# Altium schematic sheet Indikator.SchDoc
size A
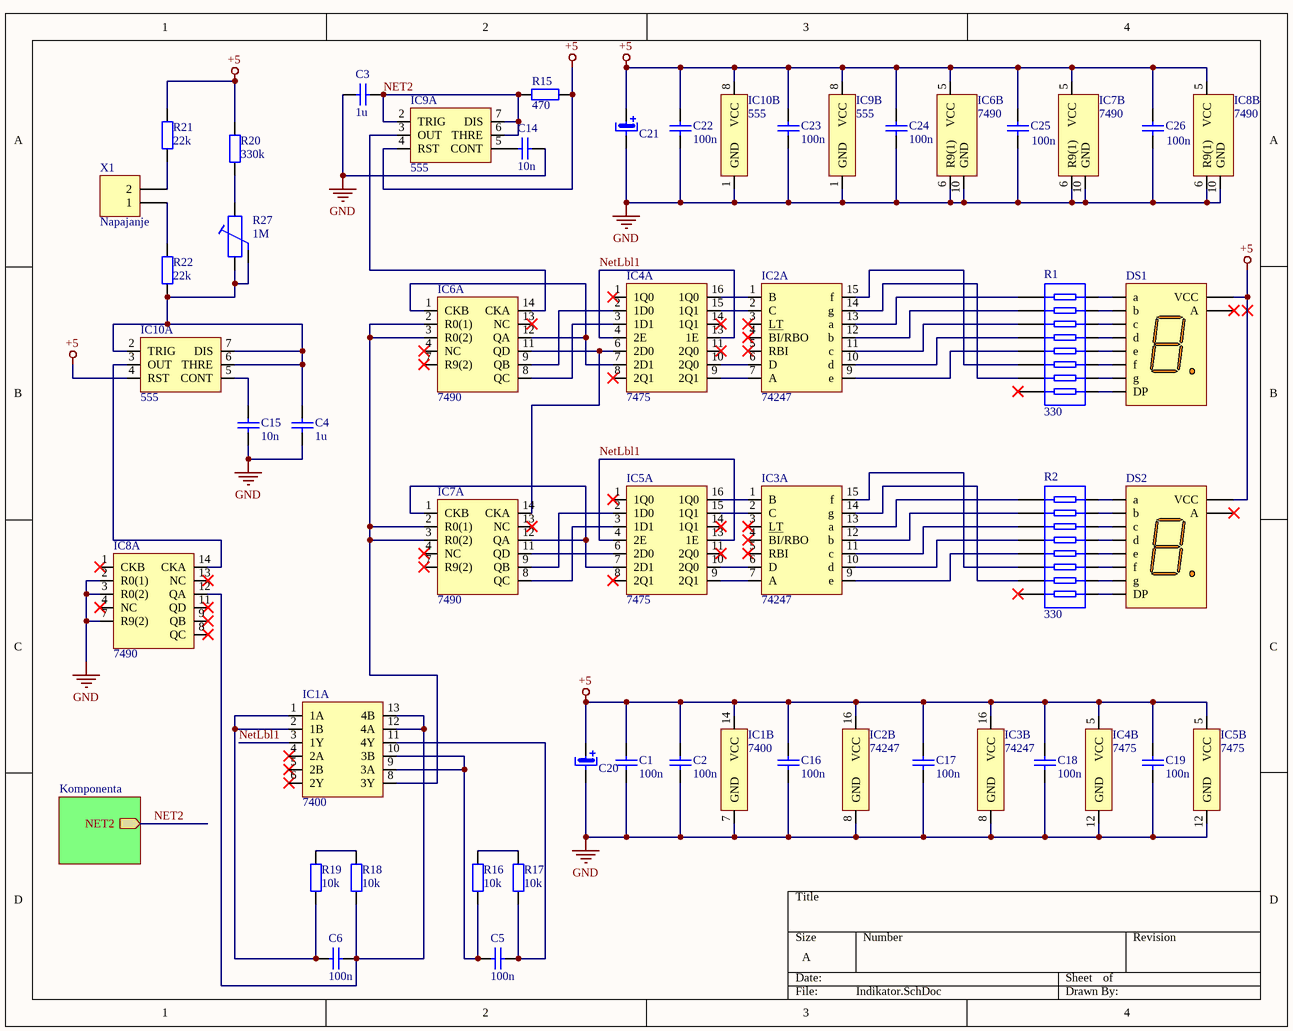
[diagram p0: Indikator.SchDoc]

## Parts
C1  100n  [RAD-0.3]
C2  100n  [RAD-0.3]
C3  1u  [RAD-0.3]
C4  1u  [RAD-0.3]
C5  100n  [RAD-0.3]
C6  100n  [RAD-0.3]
C14  10n  [RAD-0.3]
C15  10n  [RAD-0.3]
C16  100n  [RAD-0.3]
C17  100n  [RAD-0.3]
C18  100n  [RAD-0.3]
C19  100n  [RAD-0.3]
C20  Elko  [RB7.6-15]  (value not drawn)
C21  Elko  [RB7.6-15]  (value not drawn)
C22  100n  [RAD-0.3]
C23  100n  [RAD-0.3]
C24  100n  [RAD-0.3]
C25  100n  [RAD-0.3]
C26  100n  [RAD-0.3]
DS1  Dpy Amber-CA  [A]  (value not drawn)
DS2  Dpy Amber-CA  [A]  (value not drawn)
IC1  7400  [DIP-14]  (parts A,B of 2)
IC2  74247  [DIP-16]  (parts A,B of 2)
IC3  74247  [DIP-16]  (parts A,B of 2)
IC4  7475  [DIP-16]  (parts A,B of 2)
IC5  7475  [DIP-16]  (parts A,B of 2)
IC6  7490  [DIP-14]  (parts A,B of 2)
IC7  7490  [DIP-14]  (parts A,B of 2)
IC8  7490  [DIP-14]  (parts A,B of 2)
IC9  555  [DIP-8]  (parts A,B of 2)
IC10  555  [DIP-8]  (parts A,B of 2)
R1  330  [SSOP16_N]
R2  330  [SSOP16_N]
R15  470  [AXIAL-0.4]
R16  10k  [AXIAL-0.4]
R17  10k  [AXIAL-0.4]
R18  10k  [AXIAL-0.4]
R19  10k  [AXIAL-0.4]
R20  330k  [AXIAL-0.4]
R21  22k  [AXIAL-0.4]
R22  22k  [AXIAL-0.4]
R27  1M  [14-1210]
X1  Napajanje  [HDR1X2]

## Sub-sheets
Komponenta = Komponenta: NET2 (out)

## Nets
+5: C1.2 C2.2 C16.2 C17.2 C18.2 C19.2 C20.1 C21.1 C22.2 C23.2 C24.2 C25.2 C26.2 DS1.1(VCC) DS2.1(VCC) IC1.14(VCC) IC2.16(VCC) IC3.16(VCC) IC4.5(VCC) IC5.5(VCC) IC6.5(VCC) IC7.5(VCC) IC8.5(VCC) IC9.4(RST) IC9.8(VCC) IC10.4(RST) IC10.8(VCC) R15.2 R20.2 R21.2
GND: C1.1 C2.1 C3.1 C4.2 C14.2 C15.1 C16.1 C17.1 C18.1 C19.1 C20.2 C21.2 C22.1 C23.1 C24.1 C25.1 C26.1 IC1.7(GND) IC2.8(GND) IC3.8(GND) IC4.12(GND) IC5.12(GND) IC6.6(R9(1)) IC6.10(GND) IC7.6(R9(1)) IC7.10(GND) IC8.2(R0(1)) IC8.3(R0(2)) IC8.6(R9(1)) IC8.7(R9(2)) IC8.10(GND) IC9.1(GND) IC10.1(GND)
NET2: C3.2 IC9.2(TRIG) IC9.6(THRE) IC9.7(DIS) R15.1 ; sheet Komponenta/NET2
NetLbl1: IC1.3(1Y) IC4.4(2E) IC4.13(1E) IC5.4(2E) IC5.13(1E)
NetC4_1: C4.1 IC10.2(TRIG) IC10.6(THRE) IC10.7(DIS) R22.2 R27.1 R27.2
NetC5_1: C5.1 IC1.11(4Y) R17.1
NetC5_2: C5.2 IC1.9(3A) IC1.10(3B) R16.1
NetC6_1: C6.1 IC1.12(4A) IC1.13(4B) IC8.12(QA) R18.1
NetC6_2: C6.2 IC1.1(1A) IC1.2(1B) R19.1
NetC14_1: C14.1 IC9.5(CONT)
NetC15_2: C15.2 IC10.5(CONT)
NetDS1_2: DS1.2(f) R1.11
NetDS1_3: DS1.3(g) R1.10
NetDS1_4: DS1.4(e) R1.12
NetDS1_5: DS1.5(d) R1.13
NetDS1_7: DS1.7(DP) R1.9
NetDS1_8: DS1.8(c) R1.14
NetDS1_9: DS1.9(b) R1.15
NetDS1_10: DS1.10(a) R1.16
NetDS2_2: DS2.2(f) R2.11
NetDS2_3: DS2.3(g) R2.10
NetDS2_4: DS2.4(e) R2.12
NetDS2_5: DS2.5(d) R2.13
NetDS2_7: DS2.7(DP) R2.9
NetDS2_8: DS2.8(c) R2.14
NetDS2_9: DS2.9(b) R2.15
NetDS2_10: DS2.10(a) R2.16
NetIC1_8: IC1.8(3Y) IC6.2(R0(1)) IC6.3(R0(2)) IC7.2(R0(1)) IC7.3(R0(2))
NetIC2_1: IC2.1(B) IC4.16(1Q0)
NetIC2_2: IC2.2(C) IC4.15(1Q1)
NetIC2_6: IC2.6(D) IC4.10(2Q0)
NetIC2_7: IC2.7(A) IC4.9(2Q1)
NetIC2_9: IC2.9(e) R1.5
NetIC2_10: IC2.10(d) R1.4
NetIC2_11: IC2.11(c) R1.3
NetIC2_12: IC2.12(b) R1.2
NetIC2_13: IC2.13(a) R1.1
NetIC2_14: IC2.14(g) R1.7
NetIC2_15: IC2.15(f) R1.6
NetIC3_1: IC3.1(B) IC5.16(1Q0)
NetIC3_2: IC3.2(C) IC5.15(1Q1)
NetIC3_6: IC3.6(D) IC5.10(2Q0)
NetIC3_7: IC3.7(A) IC5.9(2Q1)
NetIC3_9: IC3.9(e) R2.5
NetIC3_10: IC3.10(d) R2.4
NetIC3_11: IC3.11(c) R2.3
NetIC3_12: IC3.12(b) R2.2
NetIC3_13: IC3.13(a) R2.1
NetIC3_14: IC3.14(g) R2.7
NetIC3_15: IC3.15(f) R2.6
NetIC4_2: IC4.2(1D0) IC6.9(QB)
NetIC4_3: IC4.3(1D1) IC6.8(QC)
NetIC4_6: IC4.6(2D0) IC6.11(QD) IC7.14(CKA)
NetIC4_7: IC4.7(2D1) IC6.1(CKB) IC6.12(QA)
NetIC5_2: IC5.2(1D0) IC7.9(QB)
NetIC5_3: IC5.3(1D1) IC7.8(QC)
NetIC5_6: IC5.6(2D0) IC7.11(QD)
NetIC5_7: IC5.7(2D1) IC7.1(CKB) IC7.12(QA)
NetIC6_14: IC6.14(CKA) IC9.3(OUT)
NetIC8_14: IC8.14(CKA) IC10.3(OUT)
NetR16_2: R16.2 R17.2
NetR18_2: R18.2 R19.2
NetR20_1: R20.1 R27.0
NetR21_1: R21.1 X1.2
NetR22_1: R22.1 X1.1

Not connected (* = marked no-connect by the designer): DS1 6(A)*; DS2 6(A)*; IC1 4(2A)* 5(2B)* 6(2Y)*; IC2 3(LT)* 4(BI/RBO)* 5(RBI)*; IC3 3(LT)* 4(BI/RBO)* 5(RBI)*; IC4 1(1Q0)* 8(2Q1)* 11(2Q0)* 14(1Q1)*; IC5 1(1Q0)* 8(2Q1)* 11(2Q0)* 14(1Q1)*; IC6 4(NC)* 7(R9(2))* 13(NC)*; IC7 4(NC)* 7(R9(2))* 13(NC)*; IC8 1(CKB)* 4(NC)* 8(QC)* 9(QB)* 11(QD)* 13(NC)*; R1 8*; R2 8*

## Library data of the parts
C1-C6 C15-C19 C22-C26 = Cap: Capacitor; Published: 8-Jun-2000; LatestRevisionDate: 17-Jul-2002; LatestRevisionNote: Re-released for DXP Platform.; PackageReference: RAD-0.3; Publisher: Altium Limited; PackageDescription: Radial Cap, Thru-Hole; 2 Leads; 0.3 in Pin Spacing
C14 = Cap: Capacitor; Value: 100pF; Published: 8-Jun-2000; LatestRevisionDate: 17-Jul-2002; LatestRevisionNote: Re-released for DXP Platform.; PackageReference: RAD-0.3; Publisher: Altium Limited; PackageDescription: Radial Cap, Thru-Hole; 2 Leads; 0.3 in Pin Spacing
C20 C21 = Elko: Dobavljač: Farnell; Kat. broj: 1236670
DS1 DS2 = Dpy Amber-CA: 7.62 mm Black Surface Orange 7-Segment Display: CA, RH DP; MinimumIntensity: 354 ucd; Note: IF = 5 mA; Note: Pins 1 and 6 are redundant Anodes.; Published: 8-Jun-2000; LatestRevisionDate: 17-Dec-2003; LatestRevisionNote: Schematic revised, PCB Footprint replaced.; DatasheetVersion: 19-Feb-2002; PackageVersion: 11-Feb-2002; PackageReference: A; Publisher: Altium Limited; PackageDescription: LED, 7-Segment Display, 7.62 mm, RHD; 10 Leads; Row Space 5.08 mm; Pitch 2.54 mm; Colour: Orange; ComponentLink1Description: Manufacturer Link; ComponentLink1URL: http://www.agilent.com/
IC1 = 7400: Cijena: 0.441; Dobavljač: Farnell; Kat. broj: 3120183; Tip: 7400
IC2 IC3 = 74247: Cijena: 1.41; Dobavljač: Farnell; Kat. broj: 3119930; Tip: 74247
IC4 = 7475: Dobavljač: Farnell; Kat. broj: 3120693
IC5 = 7475: Cijena: 0.691; Dobavljač: Farnell; Kat. broj: 3120693; Tip: 7475
IC6 = 7490: Dobavljač: Farnell; Kat. broj: 1470790
IC7 IC8 = 7490: Cijena: 1.33; Dobavljač: Farnell; Kat. broj: 1470790; Tip: 7490
IC9 IC10 = 555: Cijena: 0.232; Dobavljač: Farnell; Kat. broj: 3121192RL; Tip: 555
R1 R2 = Res Pack4: Isolated Resistor Network; Published: 24-Mar-1999; LatestRevisionDate: 29-May-2009; LatestRevisionNote: IPC-7351 Footprint Added.; PackageVersion: Oct-2003; PackageReference: SSOP16; Publisher: Altium Limited; PackageDescription: 16-Pin Plastic Small Outline Package 0.65 mm Pitch; Code_JEDEC: MO-150-AC; Code_IPC: SOP65P780-16
R15-R18 R20-R22 = Res2: Resistor; Published: 8-Jun-2000; LatestRevisionDate: 17-Jul-2002; LatestRevisionNote: Re-released for DXP Platform.; PackageReference: AXIAL-0.4; Publisher: Altium Limited; PackageDescription: Axial Device, Thru-Hole; 2 Leads; 0.4 in Pin Spacing
R19 = Res2: Resistor; Value: 1K; Published: 8-Jun-2000; LatestRevisionDate: 17-Jul-2002; LatestRevisionNote: Re-released for DXP Platform.; PackageReference: AXIAL-0.4; Publisher: Altium Limited; PackageDescription: Axial Device, Thru-Hole; 2 Leads; 0.4 in Pin Spacing
R27 = Trimmer: Dobavljač: Farnell; Kat. broj: 9353542
X1 = Header 2: Header, 2-Pin; LatestRevisionDate: 17-Jul-2002; LatestRevisionNote: Re-released for DXP Platform.; Publisher: Altium Limited